# Altium schematic sheet Cells.SchDoc
size 152 x 63 mm
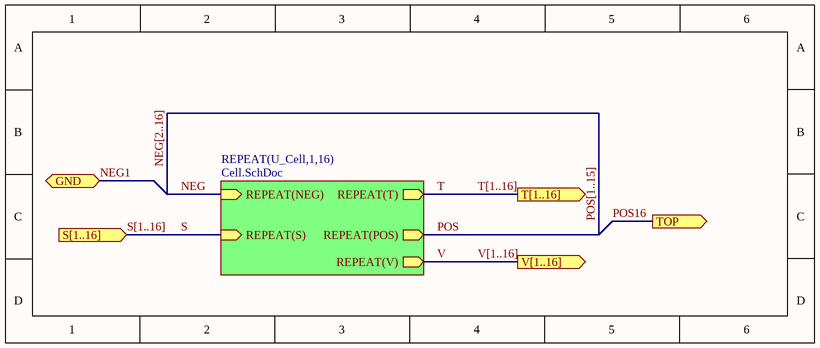
[diagram p0: Cells.SchDoc]

## Sub-sheets
REPEAT(U_Cell,1,16) = Cell.SchDoc: REPEAT(T) (out), REPEAT(NEG) (in), REPEAT(POS) (out), REPEAT(V) (out), REPEAT(S) (in)

## Ports
GND (bidir), S[1..16] (in), T[1..16] (out), TOP (out), V[1..16] (out)

## Nets
NEG: sheet REPEAT(U_Cell,1,16)/REPEAT(NEG)
NEG1: port GND
POS: sheet REPEAT(U_Cell,1,16)/REPEAT(POS)
POS16: port TOP
S: sheet REPEAT(U_Cell,1,16)/REPEAT(S)
T: sheet REPEAT(U_Cell,1,16)/REPEAT(T)  [also labelled T[1..16]]
V: sheet REPEAT(U_Cell,1,16)/REPEAT(V)  [also labelled V[1..16]]

## Buses and harness runs
bus NEG[2..16] = POS[1..15]
bus S[1..16] = port S[1..16]